# Altium schematic sheet SP8T_ecal_2.SchDoc
size B; SheetNumber: 2; SheetTotal: 3; SCH_REV: 2.0
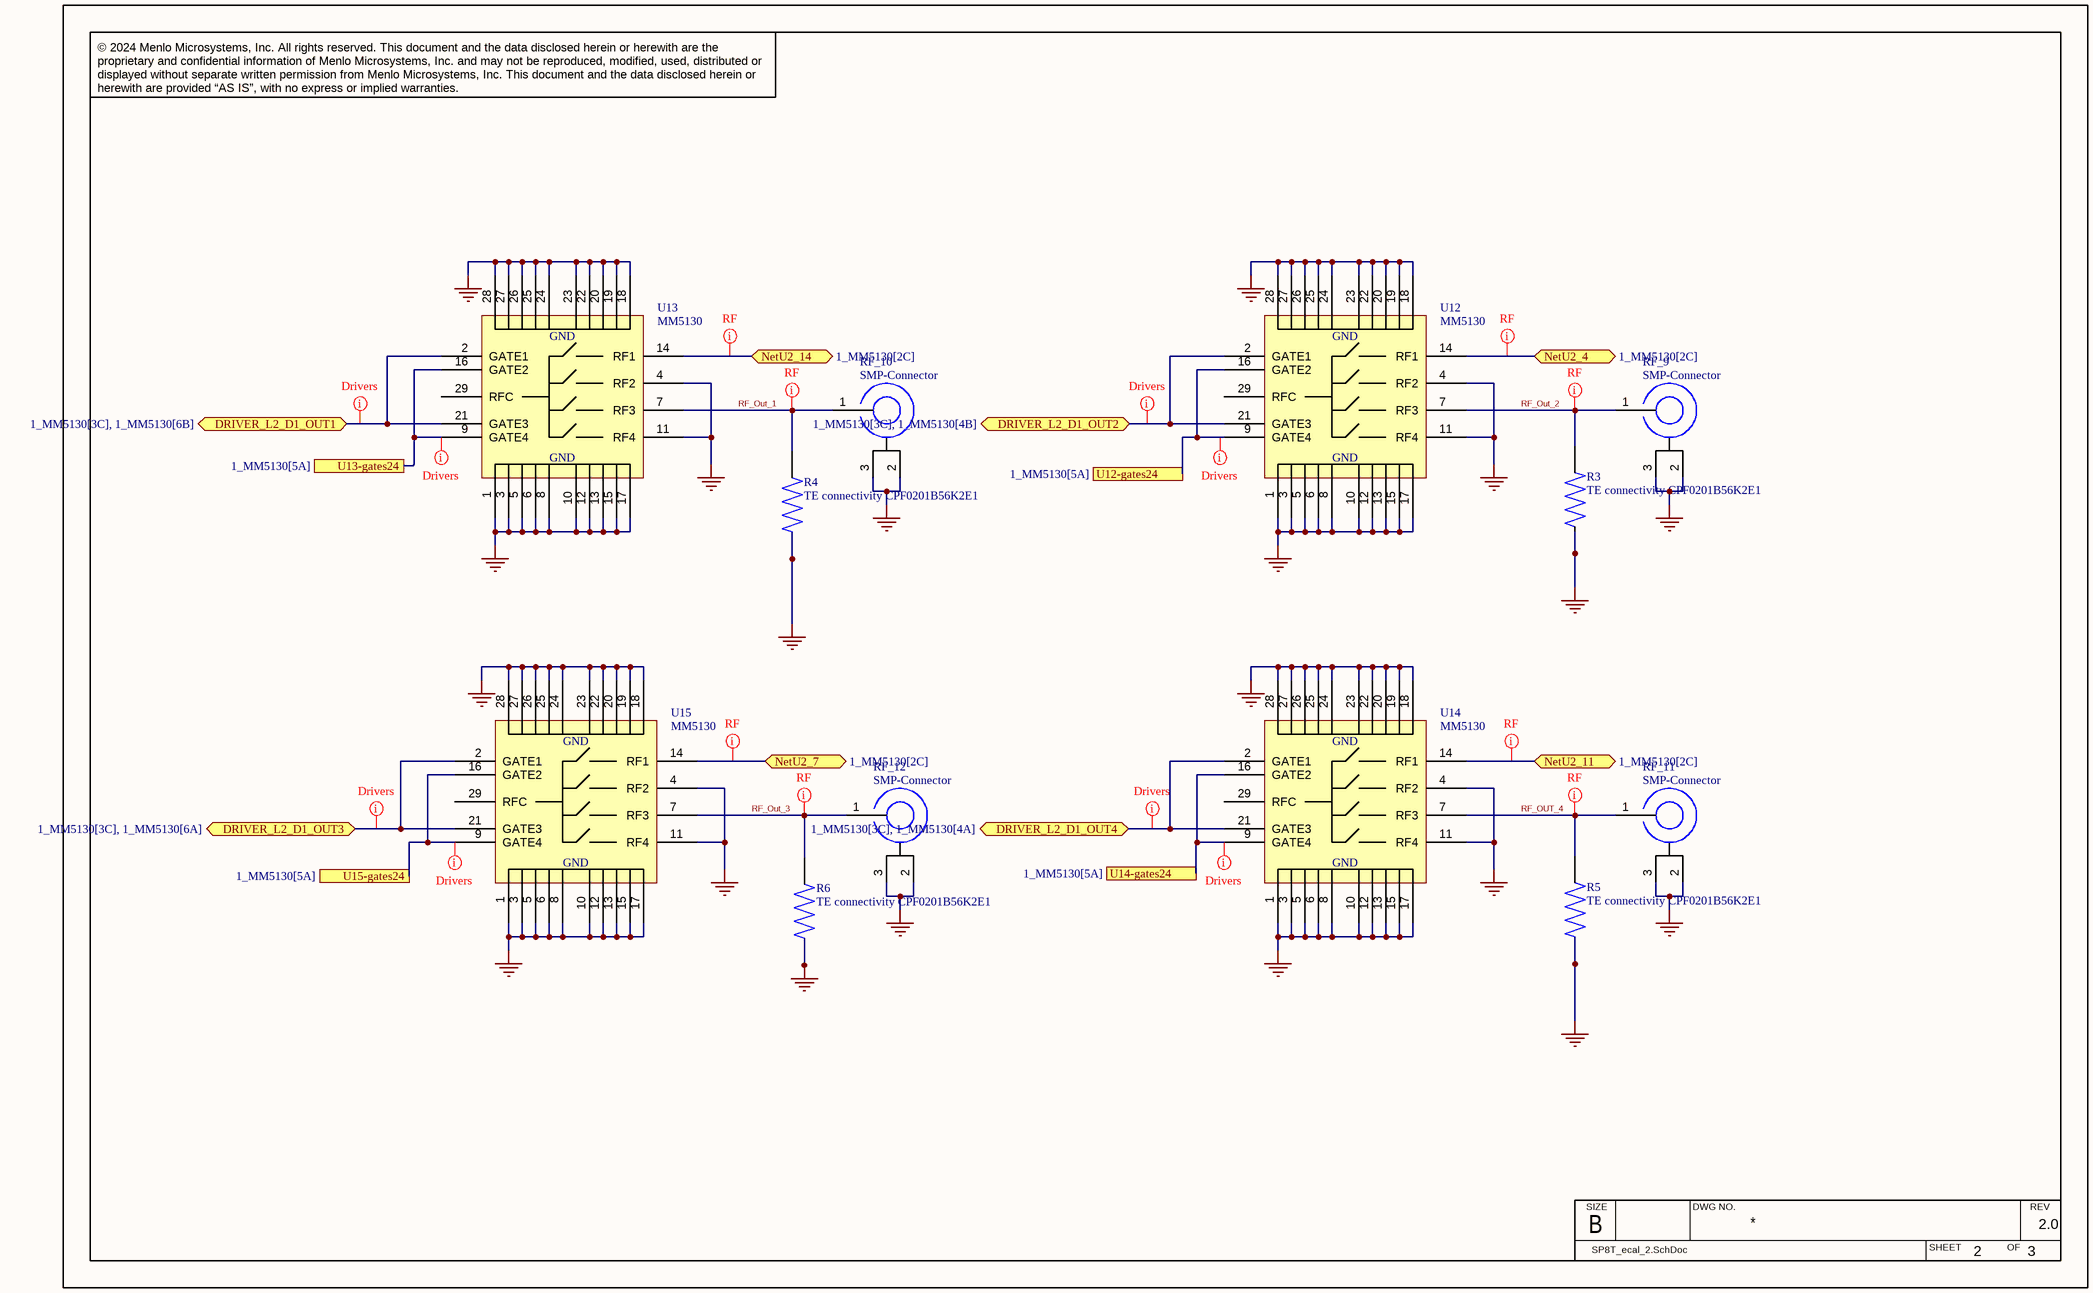
[diagram p0: SP8T_ecal_2.SchDoc]

## Parts
R3  TE connectivity CPF0201B56K2E1  [0201-resistor]
R4  TE connectivity CPF0201B56K2E1  [0201-resistor]
R5  TE connectivity CPF0201B56K2E1  [0201-resistor]
R6  TE connectivity CPF0201B56K2E1  [0201-resistor]
RF_9  Type: SMP-Connector  [CONN-PE44490]  (hidden comment: PE44490)
RF_10  Type: SMP-Connector  [CONN-PE44490]  (hidden comment: PE44490)
RF_11  Type: SMP-Connector  [CONN-PE44490]  (hidden comment: PE44490)
RF_12  Type: SMP-Connector  [CONN-PE44490]  (hidden comment: PE44490)
U12  MM5130  [MM5130-SP_M_PCB_NOFLOOD]
U13  MM5130  [MM5130-SP_M_PCB_NOFLOOD]
U14  MM5130  [MM5130-SP_M_PCB_NOFLOOD]
U15  MM5130  [MM5130-SP_M_PCB_NOFLOOD]

## Ports
DRIVER_L2_D1_OUT1 (bidir, see 1_MM5130[3C], 1_MM5130[6B]), DRIVER_L2_D1_OUT2 (bidir, see 1_MM5130[3C], 1_MM5130[4B]), DRIVER_L2_D1_OUT3 (bidir, see 1_MM5130[3C], 1_MM5130[6A]), DRIVER_L2_D1_OUT4 (bidir, see 1_MM5130[3C], 1_MM5130[4A]), NetU2_4 (bidir, see 1_MM5130[2C]), NetU2_7 (bidir, see 1_MM5130[2C]), NetU2_11 (bidir, see 1_MM5130[2C]), NetU2_14 (bidir, see 1_MM5130[2C]), U12-gates24 (see 1_MM5130[5A]), U13-gates24 (see 1_MM5130[5A]), U14-gates24 (see 1_MM5130[5A]), U15-gates24 (see 1_MM5130[5A])

## Nets
GND: R3.2 R4.2 R5.2 R6.2 RF_9.2 RF_9.3 RF_10.2 RF_10.3 RF_11.2 RF_11.3 RF_12.2 RF_12.3 U12.1(GND) U12.3(GND) U12.4(RF2) U12.5(GND) U12.6(GND) U12.8(GND) U12.10(GND) U12.11(RF4) U12.12(GND) U12.13(GND) U12.15(GND) U12.17(GND) U12.18(GND) U12.19(GND) U12.20(GND) U12.22(GND) U12.23(GND) U12.24(GND) U12.25(GND) U12.26(GND) U12.27(GND) U12.28(GND) U13.1(GND) U13.3(GND) U13.4(RF2) U13.5(GND) U13.6(GND) U13.8(GND) U13.10(GND) U13.11(RF4) U13.12(GND) U13.13(GND) U13.15(GND) U13.17(GND) U13.18(GND) U13.19(GND) U13.20(GND) U13.22(GND) U13.23(GND) U13.24(GND) U13.25(GND) U13.26(GND) U13.27(GND) U13.28(GND) U14.1(GND) U14.3(GND) U14.4(RF2) U14.5(GND) U14.6(GND) U14.8(GND) U14.10(GND) U14.11(RF4) U14.12(GND) U14.13(GND) U14.15(GND) U14.17(GND) U14.18(GND) U14.19(GND) U14.20(GND) U14.22(GND) U14.23(GND) U14.24(GND) U14.25(GND) U14.26(GND) U14.27(GND) U14.28(GND) U15.1(GND) U15.3(GND) U15.4(RF2) U15.5(GND) U15.6(GND) U15.8(GND) U15.10(GND) U15.11(RF4) U15.12(GND) U15.13(GND) U15.15(GND) U15.17(GND) U15.18(GND) U15.19(GND) U15.20(GND) U15.22(GND) U15.23(GND) U15.24(GND) U15.25(GND) U15.26(GND) U15.27(GND) U15.28(GND)
DRIVER_L2_D1_OUT1: U13.2(GATE1) U13.21(GATE3) ; port DRIVER_L2_D1_OUT1
DRIVER_L2_D1_OUT2: U12.2(GATE1) U12.21(GATE3) ; port DRIVER_L2_D1_OUT2
DRIVER_L2_D1_OUT3: U15.2(GATE1) U15.21(GATE3) ; port DRIVER_L2_D1_OUT3
DRIVER_L2_D1_OUT4: U14.2(GATE1) U14.21(GATE3) ; port DRIVER_L2_D1_OUT4
NetU2_4: U12.14(RF1) ; port NetU2_4
NetU2_7: U15.14(RF1) ; port NetU2_7
NetU2_11: U14.14(RF1) ; port NetU2_11
NetU2_14: U13.14(RF1) ; port NetU2_14
RF_Out_1: R4.1 RF_10.1 U13.7(RF3)
RF_Out_2: R3.1 RF_9.1 U12.7(RF3)
RF_Out_3: R6.1 RF_12.1 U15.7(RF3)
RF_OUT_4: R5.1 RF_11.1 U14.7(RF3)
U12-gates24: U12.9(GATE4) U12.16(GATE2) ; port U12-gates24
U13-gates24: U13.9(GATE4) U13.16(GATE2) ; port U13-gates24
U14-gates24: U14.9(GATE4) U14.16(GATE2) ; port U14-gates24
U15-gates24: U15.9(GATE4) U15.16(GATE2) ; port U15-gates24

Not connected (* = marked no-connect by the designer): U12 29(RFC); U13 29(RFC); U14 29(RFC); U15 29(RFC)

## Layout directives
net class Drivers: DRIVER_L2_D1_OUT1, DRIVER_L2_D1_OUT2, DRIVER_L2_D1_OUT3, DRIVER_L2_D1_OUT4, U12-gates24, U13-gates24, U14-gates24, U15-gates24
net class RF: NetU2_4, NetU2_7, NetU2_11, NetU2_14, RF_Out_1, RF_Out_2, RF_Out_3, RF_OUT_4

## Notes on the sheet
- © 2024 Menlo Microsystems, Inc. All rights reserved. This document and the data disclosed herein or herewith are the proprietary and confidential information of Menlo Microsystems, Inc. and may not be reproduced, modified, used, distributed or displayed without separate written permission from Menlo Microsystems, Inc. This document and the data disclosed herein or herewith are provided “AS IS”, with no express or implied warranties.
- SIZE
- B
- DWG NO.
- SHEET
- OF
- REV

## Library data of the parts
R3-R6 = TE connectivity CPF0201B56K2E1: CPF 0201 56K2 0.1% 25PPM 1K RL; MP: ERJ1GN0R00C; Value: 56k; Availability: Unavailable; Price: None; Package: None; Mfgr: TE connectivity; Mfgr Part No.: CPF0201B56K2E1
RF_9-RF_12 = CONN-PE44490: SMP, Mini Connector Plug, Male Pin 50 Ohms Board Edge, Cutout; Surface Mount Solder; Manufacturer: Pasternack; Manufacturer_Part_Number: PE44490
U12-U15 = IC-MM5130: High power SP4T MEMs switch